# Altium schematic sheet Analog Input.SchDoc
size A4; SheetNumber: 8; SheetTotal: 11
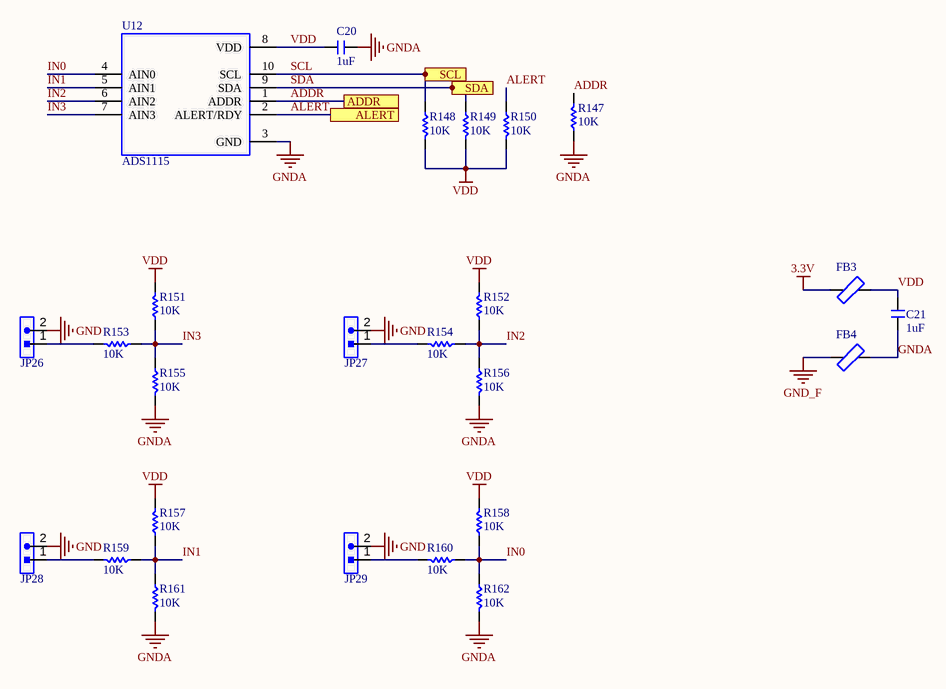
[diagram p0: Analog Input.SchDoc]

## Parts
C20  1uF  [C 0805]
C21  1uF  [C 0805]
FB3  (no value)  [F 0805]
FB4  (no value)  [F 0805]
JP26  HDR-1X2  [KF301-2P]  (value not drawn)
JP27  HDR-1X2  [KF301-2P]  (value not drawn)
JP28  HDR-1X2  [KF301-2P]  (value not drawn)
JP29  HDR-1X2  [KF301-2P]  (value not drawn)
R147  10K  [R 0805]
R148  10K  [R 0805]
R149  10K  [R 0805]
R150  10K  [R 0805]
R151  10K  [R 0805]
R152  10K  [R 0805]
R153  10K  [R 0805]
R154  10K  [R 0805]
R155  10K  [R 0805]
R156  10K  [R 0805]
R157  10K  [R 0805]
R158  10K  [R 0805]
R159  10K  [R 0805]
R160  10K  [R 0805]
R161  10K  [R 0805]
R162  10K  [R 0805]
U12  ADS1115  [VSSOP10-N]

## Ports
ADDR, ALERT, SCL, SDA

## Nets
3.3V: FB3.1
GND: JP26.2 JP27.2 JP28.2 JP29.2
GND_F: FB4.1
GNDA: C20.1 C21.1 FB4.2 R147.1 R155.2 R156.2 R161.2 R162.2 U12.3(GND)
VDD: C20.2 C21.2 FB3.2 R148.2 R149.2 R150.2 R151.2 R152.2 R157.2 R158.2 U12.8(VDD)
ADDR: R147.2 U12.1(ADDR) ; port ADDR
ALERT: R150.1 U12.2(ALERT/RDY) ; port ALERT
IN0: R158.1 R160.1 R162.1 U12.4(AIN0)
IN1: R157.1 R159.1 R161.1 U12.5(AIN1)
IN2: R152.1 R154.1 R156.1 U12.6(AIN2)
IN3: R151.1 R153.1 R155.1 U12.7(AIN3)
SCL: R148.1 U12.10(SCL) ; port SCL
SDA: R149.1 U12.9(SDA) ; port SDA
NetJP26_1: JP26.1 R153.2
NetJP27_1: JP27.1 R154.2
NetJP28_1: JP28.1 R159.2
NetJP29_1: JP29.1 R160.2

## Library data of the parts
C20 C21 = C: Non-polar patch capacitor; BOM名称: 无极性贴片电容; 版权归属: 源创客; 学习资源: www.ooocke.com
FB3 FB4 = FB: Ferrite Bead; BOM名称: 贴片电阻; 版权归属: 源创客; 学习资源: www.ooocke.com
JP26-JP29 = Header 2: 2P Connector; BOM名称: 2P接插件; 版权归属: 源创客; 学习资源: www.ooocke.com
R147-R162 = R: Chip resistor; 版权归属: 源创客; BOM名称: Chip resistor; 学习资源: www.ooocke.com
U12 = ADS1115: ADS111x Ultra-Small, Low-Power, I / 2C-Compatible, 860-SPS, 16-Bit ADCs / With Internal Reference, Oscillator, and Programmable Comparator; BOM名称: 数字电位器; 版权归属: 源创客; 学习资源: www.ooocke.com